# Altium schematic sheet 2_FPGA.SchDoc: AX301 Http://www.heijin.org
size OrCAD A; DocumentNumber: 2; Revision: 1.0; SheetNumber: 2; SheetTotal: 7; PageSetup: Record=PageOptions|CenterHorizontal=True|CenterVertical=True|PrintScale=1.03|XCorrection=1.00|YCorrection=1.00|PrintKind=0|BorderSize=5000000|LeftOffset=0|BottomOffset=0|Orientation=2|PaperLength=1000|PaperWidth=1000|Scale=100|PaperSource=15|PrintQuality=1200|MediaType=1|DitherType=10|PrintScaleMode=1|PaperKind=A4|PaperIndex=9
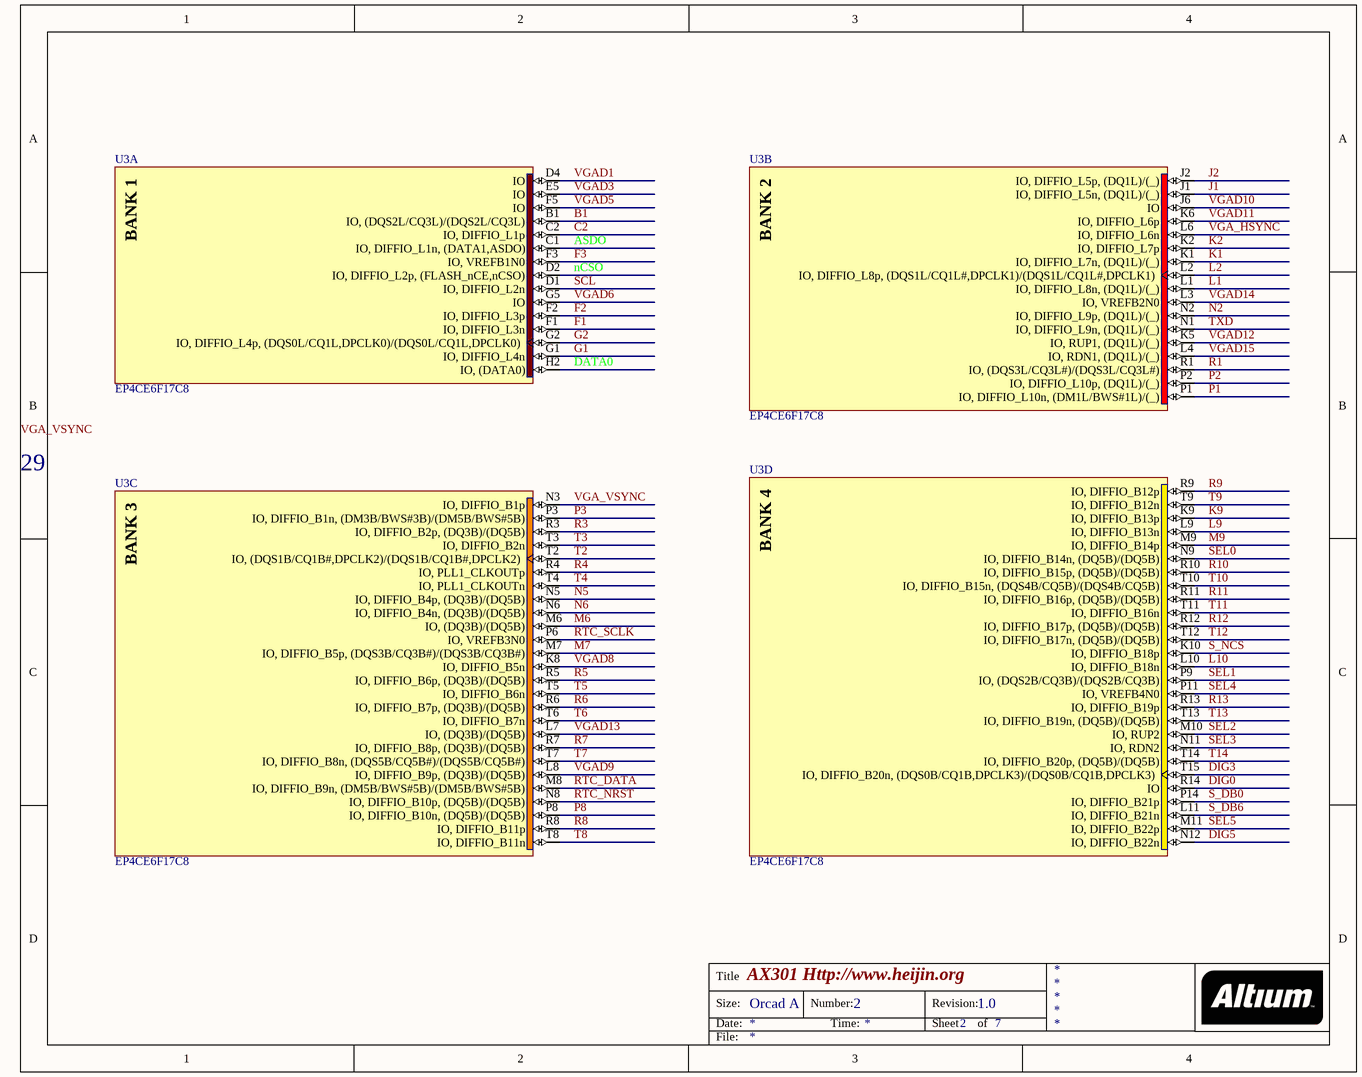
[diagram p0: 2_FPGA.SchDoc]

## Parts
U3  EP4CE6F17C8  [FBGA256]  (parts A,B,C,D of 13)

## Nets
ASDO: U3.C1(IO,_DIFFIO_L1n,_(DATA1,ASDO))
B1: U3.B1(IO,_(DQS2L/CQ3L)/(DQS2L/CQ3L))
C2: U3.C2(IO,_DIFFIO_L1p)
DATA0: U3.H2(IO,_(DATA0))
DIG0: U3.R14(IO)
DIG3: U3.T15(IO,_DIFFIO_B20n,_(DQS0B/CQ1B,DPCLK3)/(DQS0B/CQ1B,DPCLK3))
DIG5: U3.N12(IO,_DIFFIO_B22n)
F1: U3.F1(IO,_DIFFIO_L3n)
F2: U3.F2(IO,_DIFFIO_L3p)
F3: U3.F3(IO,_VREFB1N0)
G1: U3.G1(IO,_DIFFIO_L4n)
G2: U3.G2(IO,_DIFFIO_L4p,_(DQS0L/CQ1L,DPCLK0)/(DQS0L/CQ1L,DPCLK0))
J1: U3.J1(IO,_DIFFIO_L5n,_(DQ1L)/(_))
J2: U3.J2(IO,_DIFFIO_L5p,_(DQ1L)/(_))
K1: U3.K1(IO,_DIFFIO_L7n,_(DQ1L)/(_))
K2: U3.K2(IO,_DIFFIO_L7p)
K9: U3.K9(IO,_DIFFIO_B13p)
L1: U3.L1(IO,_DIFFIO_L8n,_(DQ1L)/(_))
L2: U3.L2(IO,_DIFFIO_L8p,_(DQS1L/CQ1L#,DPCLK1)/(DQS1L/CQ1L#,DPCLK1))
L9: U3.L9(IO,_DIFFIO_B13n)
L10: U3.L10(IO,_DIFFIO_B18n)
M6: U3.M6(IO,_(DQ3B)/(DQ5B))
M7: U3.M7(IO,_DIFFIO_B5p,_(DQS3B/CQ3B#)/(DQS3B/CQ3B#))
M9: U3.M9(IO,_DIFFIO_B14p)
N2: U3.N2(IO,_DIFFIO_L9p,_(DQ1L)/(_))
N5: U3.N5(IO,_DIFFIO_B4p,_(DQ3B)/(DQ5B))
N6: U3.N6(IO,_DIFFIO_B4n,_(DQ3B)/(DQ5B))
nCSO: U3.D2(IO,_DIFFIO_L2p,_(FLASH_nCE,nCSO))
P1: U3.P1(IO,_DIFFIO_L10n,_(DM1L/BWS#1L)/(_))
P2: U3.P2(IO,_DIFFIO_L10p,_(DQ1L)/(_))
P3: U3.P3(IO,_DIFFIO_B1n,_(DM3B/BWS#3B)/(DM5B/BWS#5B))
P8: U3.P8(IO,_DIFFIO_B10n,_(DQ5B)/(DQ5B))
R1: U3.R1(IO,_(DQS3L/CQ3L#)/(DQS3L/CQ3L#))
R3: U3.R3(IO,_DIFFIO_B2p,_(DQ3B)/(DQ5B))
R4: U3.R4(IO,_PLL1_CLKOUTp)
R5: U3.R5(IO,_DIFFIO_B6p,_(DQ3B)/(DQ5B))
R6: U3.R6(IO,_DIFFIO_B7p,_(DQ3B)/(DQ5B))
R7: U3.R7(IO,_DIFFIO_B8p,_(DQ3B)/(DQ5B))
R8: U3.R8(IO,_DIFFIO_B11p)
R9: U3.R9(IO,_DIFFIO_B12p)
R10: U3.R10(IO,_DIFFIO_B15p,_(DQ5B)/(DQ5B))
R11: U3.R11(IO,_DIFFIO_B16p,_(DQ5B)/(DQ5B))
R12: U3.R12(IO,_DIFFIO_B17p,_(DQ5B)/(DQ5B))
R13: U3.R13(IO,_DIFFIO_B19p)
RTC_DATA: U3.M8(IO,_DIFFIO_B9n,_(DM5B/BWS#5B)/(DM5B/BWS#5B))
RTC_NRST: U3.N8(IO,_DIFFIO_B10p,_(DQ5B)/(DQ5B))
RTC_SCLK: U3.P6(IO,_VREFB3N0)
S_DB0: U3.P14(IO,_DIFFIO_B21p)
S_DB6: U3.L11(IO,_DIFFIO_B21n)
S_NCS: U3.K10(IO,_DIFFIO_B18p)
SCL: U3.D1(IO,_DIFFIO_L2n)
SEL0: U3.N9(IO,_DIFFIO_B14n,_(DQ5B)/(DQ5B))
SEL1: U3.P9(IO,_(DQS2B/CQ3B)/(DQS2B/CQ3B))
SEL2: U3.M10(IO,_RUP2)
SEL3: U3.N11(IO,_RDN2)
SEL4: U3.P11(IO,_VREFB4N0)
SEL5: U3.M11(IO,_DIFFIO_B22p)
T2: U3.T2(IO,_(DQS1B/CQ1B#,DPCLK2)/(DQS1B/CQ1B#,DPCLK2))
T3: U3.T3(IO,_DIFFIO_B2n)
T4: U3.T4(IO,_PLL1_CLKOUTn)
T5: U3.T5(IO,_DIFFIO_B6n)
T6: U3.T6(IO,_DIFFIO_B7n)
T7: U3.T7(IO,_DIFFIO_B8n,_(DQS5B/CQ5B#)/(DQS5B/CQ5B#))
T8: U3.T8(IO,_DIFFIO_B11n)
T9: U3.T9(IO,_DIFFIO_B12n)
T10: U3.T10(IO,_DIFFIO_B15n,_(DQS4B/CQ5B)/(DQS4B/CQ5B))
T11: U3.T11(IO,_DIFFIO_B16n)
T12: U3.T12(IO,_DIFFIO_B17n,_(DQ5B)/(DQ5B))
T13: U3.T13(IO,_DIFFIO_B19n,_(DQ5B)/(DQ5B))
T14: U3.T14(IO,_DIFFIO_B20p,_(DQ5B)/(DQ5B))
TXD: U3.N1(IO,_DIFFIO_L9n,_(DQ1L)/(_))
VGA_HSYNC: U3.L6(IO,_DIFFIO_L6n)
VGA_VSYNC: U3.N3(IO,_DIFFIO_B1p)
VGAD1: U3.D4(IO)
VGAD3: U3.E5(IO)
VGAD5: U3.F5(IO)
VGAD6: U3.G5(IO)
VGAD8: U3.K8(IO,_DIFFIO_B5n)
VGAD9: U3.L8(IO,_DIFFIO_B9p,_(DQ3B)/(DQ5B))
VGAD10: U3.J6(IO)
VGAD11: U3.K6(IO,_DIFFIO_L6p)
VGAD12: U3.K5(IO,_RUP1,_(DQ1L)/(_))
VGAD13: U3.L7(IO,_(DQ3B)/(DQ5B))
VGAD14: U3.L3(IO,_VREFB2N0)
VGAD15: U3.L4(IO,_RDN1,_(DQ1L)/(_))

## Notes on the sheet
- 29
- Labels drawn without touching a wire or pin: VGA_VSYNC
- Title
- Size:
- Date:
- Orcad A
- Number:
- Time:
- Revision:
- Sheet
- of
- File:
- (in symbol EP4CE6F17C8, part A) BANK 1
- (in symbol EP4CE6F17C8, part B) BANK 2
- (in symbol EP4CE6F17C8, part C) BANK 3
- (in symbol EP4CE6F17C8, part D) BANK 4

## Library data of the parts
U3 = EP4CE6F17C8: Cyclone IV Family FPGA, 2V Core, 179 I/O Pins, 2 PLLs, 256-Pin FBGA, Speed Grade 8, Commercial Grade; Published: 3-May-2010; DatasheetVersion: ver1.2, Mar-2010; PackageVersion: ver16.0, Dec-2009; PackageReference: FBGA256; Publisher: Altium Limited; PackageDescription: 256-Ball FineLine Ball Grid Array (FBGA256) - Option 1 - Wire Bond; Supplier 1: Digi-Key; Supplier Part Number 1: EP4CE6F17C8-ND; Code_JEDEC: MS-034-AAF-1; Code_IPC: BGA100P16X16-256; ComponentLink1Description: Manufacturer Link; ComponentLink1URL: http://www.altera.com/; ComponentLink2Description: Handbook; ComponentLink2URL: http://www.altera.com/literature/hb/cyclone-iv/cyclone4-handbook.pdf; ComponentLink3Description: Pinout Specification; ComponentLink3URL: http://www.altera.com/literature/lit-dp.jsp?category=cyc%204&showspreadsheet=y; ComponentLink4Description: Packaging Specification; ComponentLink4URL: http://www.altera.com/literature/ds/dspkg.pdf